# Altium schematic sheet IHM.SchDoc: IHM
size A4; ApprovedBy: Baptiste GADEBILLE; CheckedBy: Baptiste GADEBILLE; Author: Amar BOURAS; DrawnBy: Amar BOURAS; Revision: V1.0 Rev A; SheetNumber: 5; SheetTotal: 5
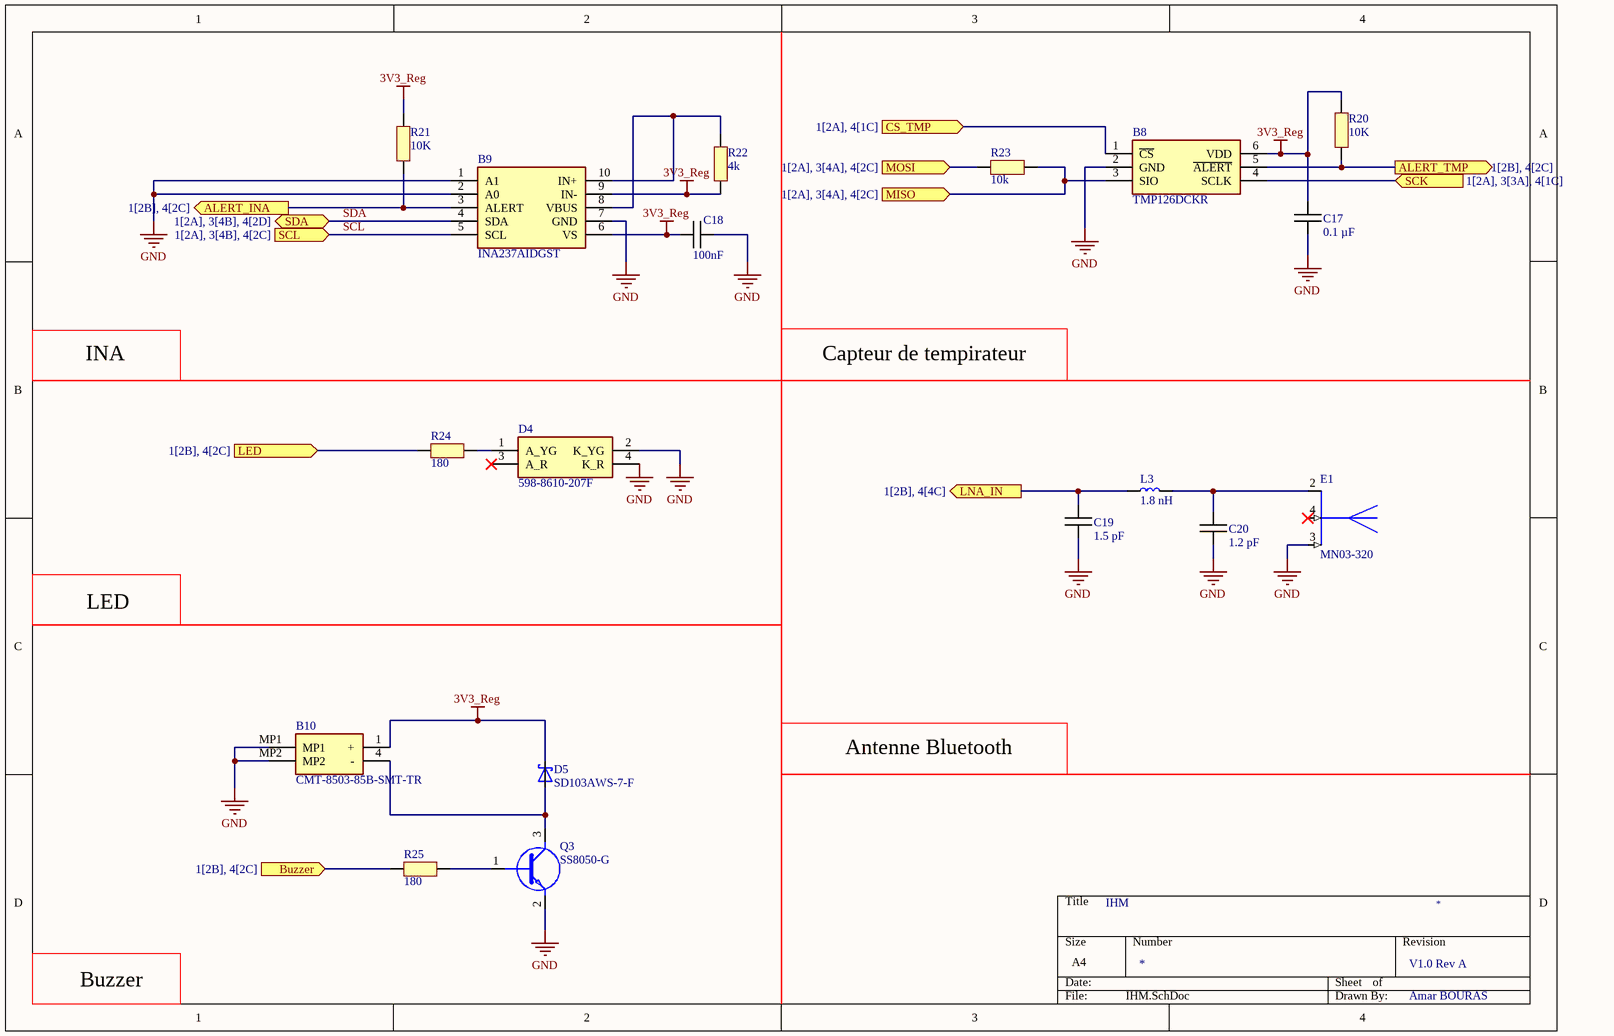
[diagram p0: IHM.SchDoc]

## Parts
B8  TMP126DCKR  [SOT65P210X110-6N]
B9  INA237AIDGST  [SOP50P490X110-10N]
B10  CMT-8503-85B-SMT-TR  [CMT850385BSMTTR]
C17  0.1 µF  [CAPC1005X06N]
C18  100nF  [CAPC1005X06N]
C19  1.5 pF  [CAPC1005X06N]
C20  1.2 pF  [CAPC1005X06N]
D4  598-8610-207F  [5988610207F]
D5  SD103AWS-7-F  [SD103AWS-7-F]
E1  MN03-320  [XCVR_NN03-320]
L3  1.8 nH  [LQPC1005X06N]
Q3  SS8050-G  [SS8050-G]
R20  10K  [RESC1005X06N]
R21  10K  [RESC1005X06N]
R22  4k  [RESC1005X06N]
R23  10k  [RESC1005X06N]
R24  180  [RESC1005X06N]
R25  180  [RESC1005X06N]

## Ports
ALERT_INA (out, see 1[2B], 4[2C]), ALERT_TMP (out, see 1[2B], 4[2C]), Buzzer (in, see 1[2B], 4[2C]), CS_TMP (in, see 1[2A], 4[1C]), LED (in, see 1[2B], 4[2C]), LNA_IN (out, see 1[2B], 4[4C]), MISO (in, see 1[2A], 3[4A], 4[2C]), MOSI (in, see 1[2A], 3[4A], 4[2C]), SCK (in, see 1[2A], 3[3A], 4[1C]), SCL (in, see 1[2A], 3[4B], 4[2C]), SDA (bidir, see 1[2A], 3[4B], 4[2D])

## Nets
3V3_Reg: B8.6(VDD) B9.6(VS) B9.9(IN-) B10.1(+) C17.2 C18.1 D5.1(C) R20.2 R21.2 R22.1
GND: B8.2(GND) B9.1(A1) B9.2(A0) B9.7(GND) B10.MP1 B10.MP2 C17.1 C18.2 C19.1 C20.1 D4.2(K_YG) D4.4(K_R) E1.3(FEED_BLUETOOTH) Q3.2(E)
ALERT_INA: B9.3(ALERT) R21.1 ; port ALERT_INA
ALERT_TMP: B8.5(~{ALERT}) R20.1 ; port ALERT_TMP
Buzzer: R25.2 ; port Buzzer
CS_TMP: B8.1(~{CS}) ; port CS_TMP
LED: R24.2 ; port LED
LNA_IN: C19.2 L3.1 ; port LNA_IN
MISO: B8.3(SIO) R23.1 ; port MISO
MOSI: R23.2 ; port MOSI
SCK: B8.4(SCLK) ; port SCK
SCL: B9.5(SCL) ; port SCL
SDA: B9.4(SDA) ; port SDA
NetB9_8: B9.8(VBUS) B9.10(IN+) R22.2
NetB10_4: B10.4(-) D5.2(A) Q3.3(C)
NetC20_2: C20.2 E1.2(GROUND) L3.2
NetD4_1: D4.1(A_YG) R24.1
NetQ3_1: Q3.1(B) R25.1

Not connected (* = marked no-connect by the designer): D4 3(A_R)*; E1 4(FEED_GNSS)*

## Notes on the sheet
- INA
- Capteur de tempirateur
- LED
- Antenne Bluetooth
- Buzzer

## Library data of the parts
B8 = TMP126DCKR: Board Mount Temperature Sensors +/-0.25 C SPI temperature sensor with 175 C operation, CRC and slew-rate alert; Manufacturer_Name: Texas Instruments; Manufacturer_Part_Number: TMP126DCKR; Mouser Part Number: 595-TMP126DCKR
B9 = INA237AIDGST: Current Sense Amplifiers 85-V, 16-bit, I2C output current/voltage/power monitor with alert 10-VSSOP -40 to 125; Manufacturer_Name: Texas Instruments; Manufacturer_Part_Number: INA237AIDGST; Mouser Part Number: 595-INA237AIDGST
B10 = CMT-8503-85B-SMT-TR: Speakers & Transducers buzzer, 8.5 mm, 3 mm deep, M, 3.6 V, 85 dB, Surface Mount (SMT), Audio Transducer; Manufacturer_Name: Same Sky; Manufacturer_Part_Number: CMT-8503-85B-SMT-TR; Mouser Part Number: 490-CMT-850385BSMTTR
C17-C20 = Capacitor
D4 = 598-8610-207F: Standard LEDs - SMD Red/Green WC 80/50mcd 645/570nm; Manufacturer_Name: Dialight; Geometry.Height: 0.8mm; Manufacturer_Part_Number: 598-8610-207F; Mouser Part Number: 645-598-8610-207F; Mouser Price/Stock: https://www.mouser.co.uk/ProductDetail/Dialight/598-8610-207F?qs=7JStj%2FjQ2SFuCjosqwklHQ%3D%3D; Arrow Part Number: 598-8610-207F; Arrow Price/Stock: https://www.arrow.com/en/products/598-8610-207f/dialight?region=nac; Datasheet Link: https://media.digikey.com/pdf/Data%20Sheets/Dialight%20PDFs/598%20Series%201210%20Pkg%20Bi-Color.pdf
D5 = SD103AWS-7-F: Diode Array 3 Independent Schottky 40V 175mA Surface Mount 6-TSSOP, SC-88, SOT-363
E1 = NN03-320: Dual port antenna booster for GNSS, Bluetooth, 5G and UWB (1561 - 1606MHz, 2400 - 2500MHz, 3400 - 3800MHz, 3100 - 4800MHz and 6000 - 10600 MHz), signal booster; Manufacturer_Name: Ignion; Manufacturer_Part_Number: NN03-320; Mouser Part Number: 128-NN03-320
L3 = Bobine
Q3 = SS8050-G: Bipolar Transistors - BJT NPN TRANSISTOR 1.5A 40V
R20-R25 = Resistor